# EasyEDA schematic SCH_Pico-Greenhouse-PCB_2026-05-22.json
TITLE: Greenhouse-Pico; REV: 2.1; Date: 2026-04-07; Sheet: 1/1; Drawn By: hiroyugane
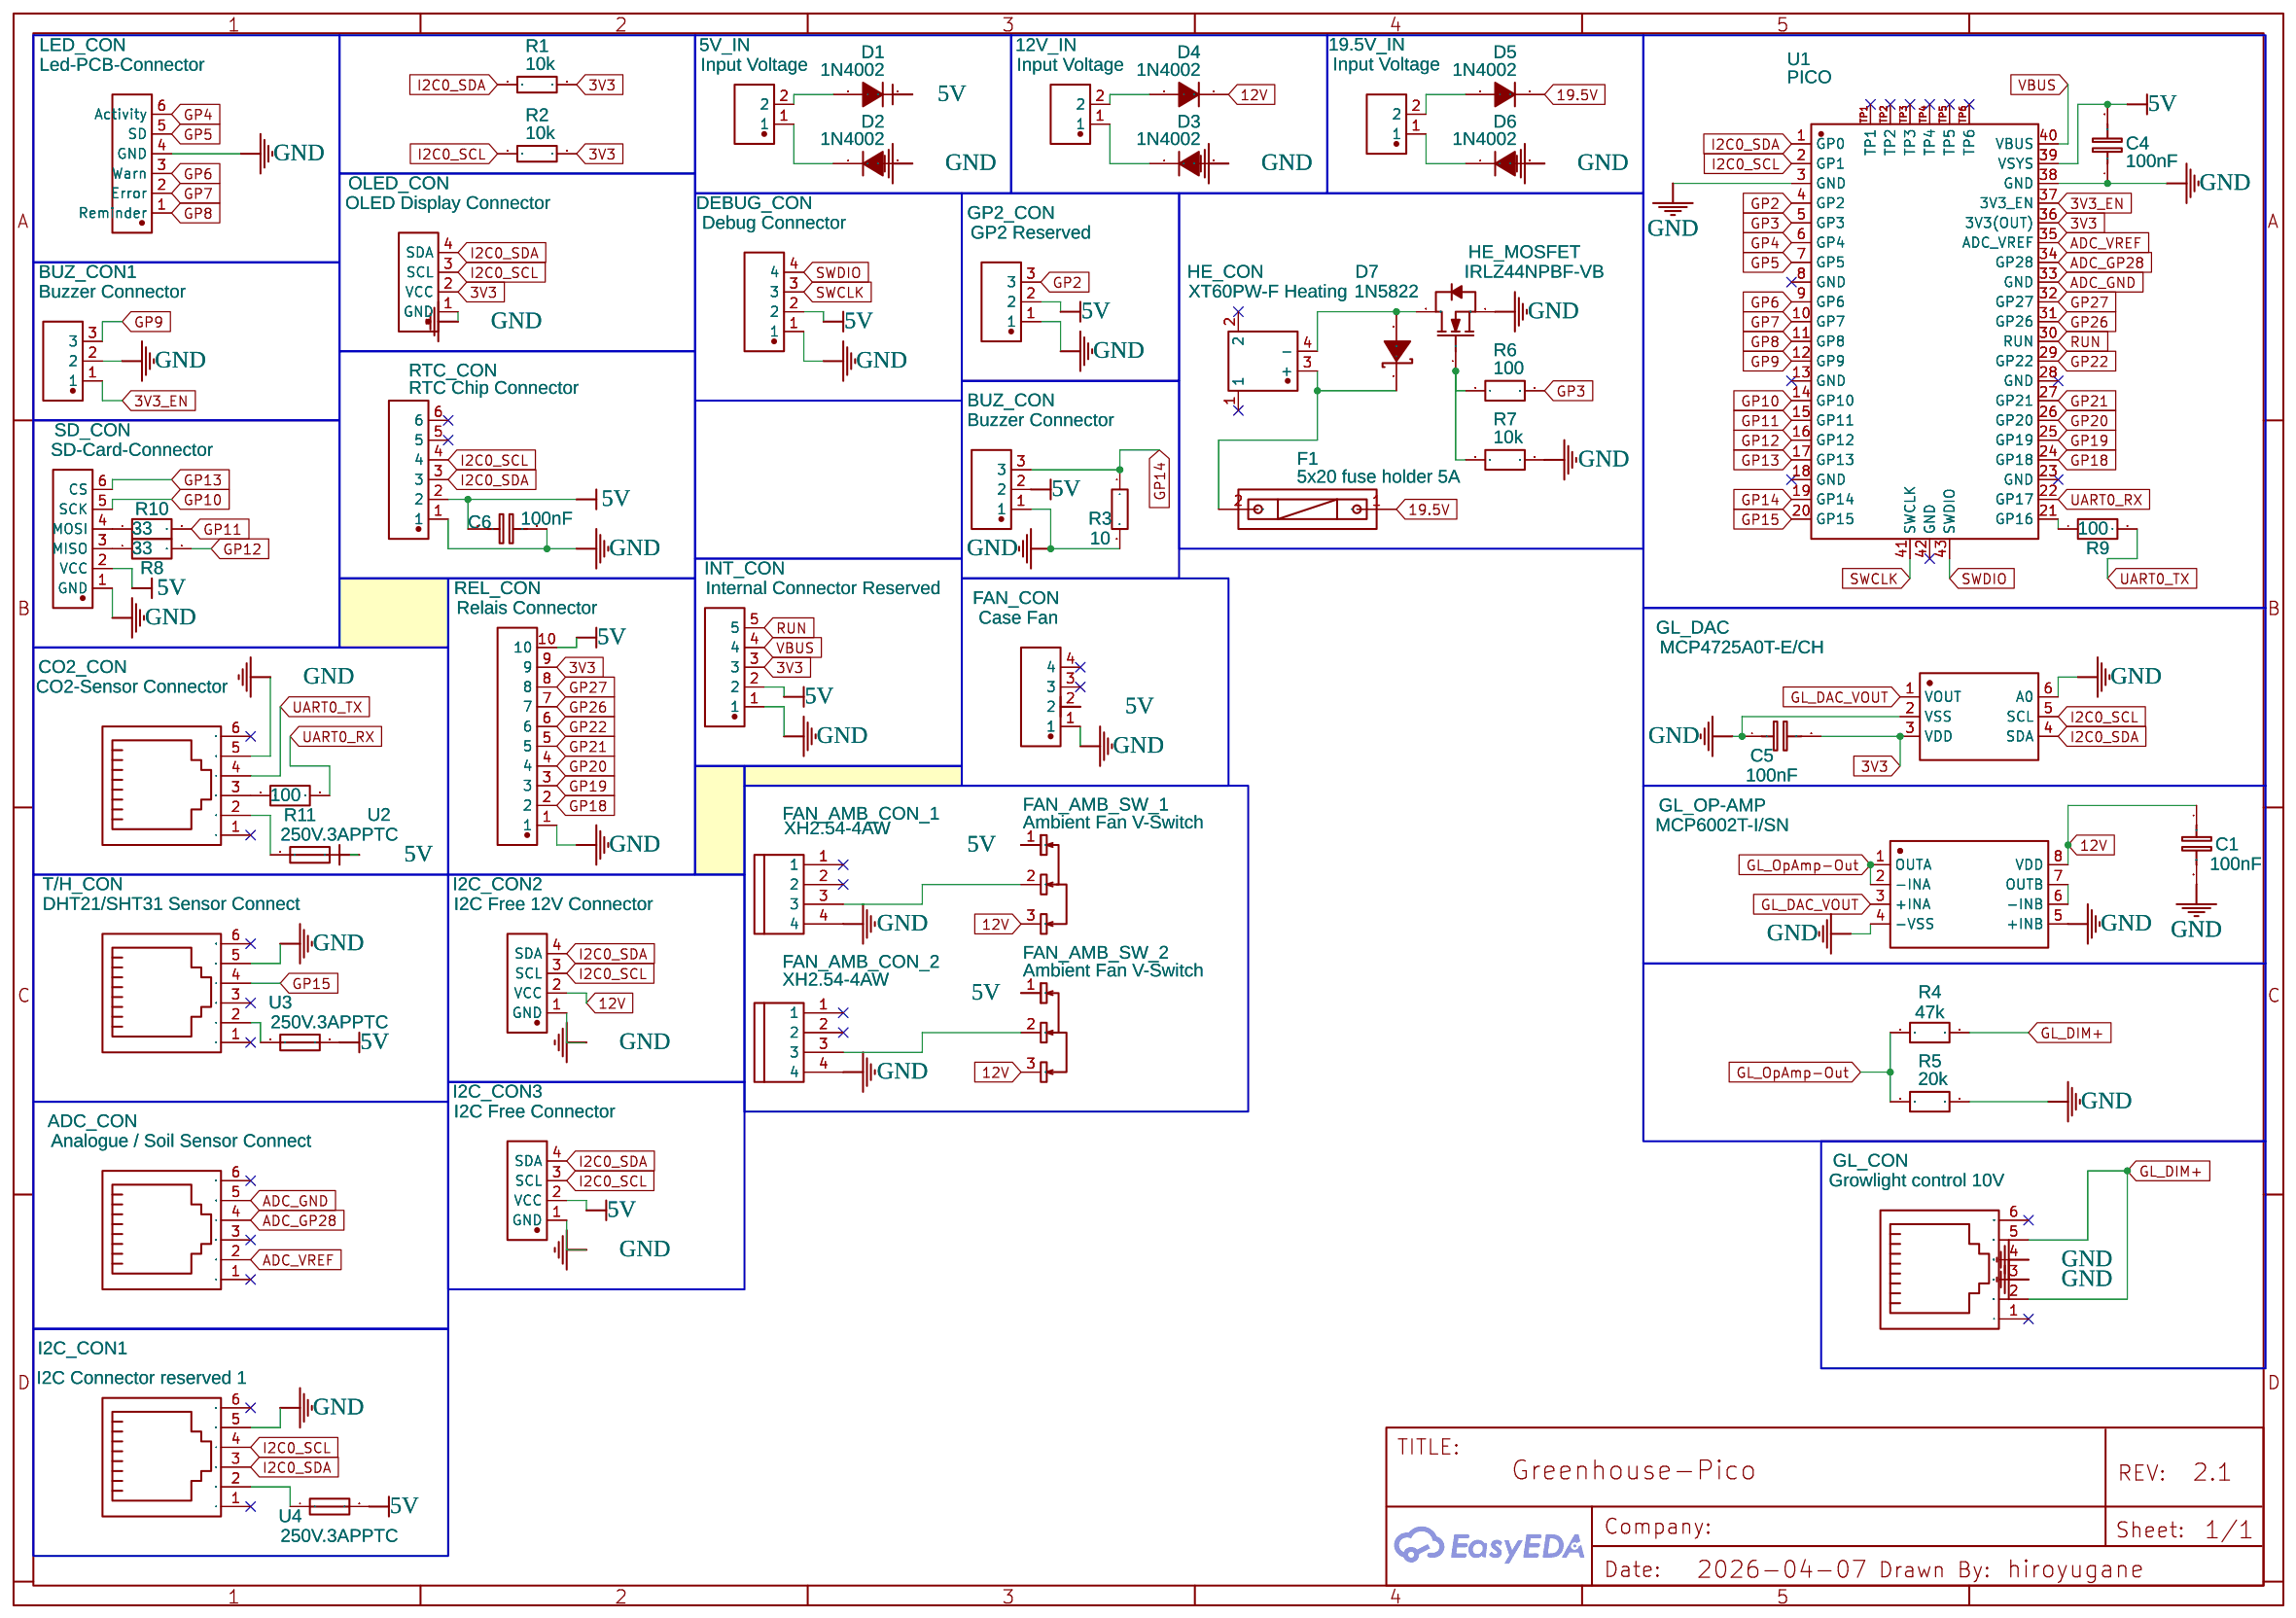
[diagram p0: schematic sheet]

## Parts
5V_IN  Input Voltage  [CONN-TH_2P-P2.50_JST_B2B-XH-A-M]
12V_IN  Input Voltage  [CONN-TH_2P-P2.50_JST_B2B-XH-A-M]
19.5V_IN  Input Voltage  [CONN-TH_2P-P5.00_1935161]
ADC_CON  Analogue / Soil Sensor Connect  [RJ12-TH_95501-2661]
BUZ_CON  Buzzer Connector  [BUZ_CON]
BUZ_CON1  Buzzer Connector  [BUZ_CON]
C1  100nF  [CONDENSATOR-SMALL]
C4  100nF  [CONDENSATOR-SMALL]
C5  100nF  [CONDENSATOR-SMALL]
C6  100nF  [CONDENSATOR-SMALL]
CO2_CON  CO2-Sensor Connector  [RJ12-TH_95501-2661]
D1  1N4002  [DO-41_BD2.4-L4.7-P8.70-D0.9-RD]
D2  1N4002  [DO-41_BD2.4-L4.7-P8.70-D0.9-RD]
D3  1N4002  [DO-41_BD2.4-L4.7-P8.70-D0.9-RD]
D4  1N4002  [DO-41_BD2.4-L4.7-P8.70-D0.9-RD]
D5  1N4002  [DO-41_BD2.4-L4.7-P8.70-D0.9-RD]
D6  1N4002  [DO-41_BD2.4-L4.7-P8.70-D0.9-RD]
D7  1N5822  [DO-201AD_BD5.3-L8.4-P12.50-D1.4-FD]
DEBUG_CON  Debug Connector  [CONN-TH_4P-P2.50_JST_B4B-XH-A-M]
F1  5x20 fuse holder 5A  [FUSE-TH_L22.6-W9.0]
FAN_AMB_CON_1  XH2.54-4AW  [CONN-TH_XH2.54-4AW]
FAN_AMB_CON_2  XH2.54-4AW  [CONN-TH_XH2.54-4AW]
FAN_AMB_SW_1  Ambient Fan V-Switch  [TH SWITCH SPDT]
FAN_AMB_SW_2  Ambient Fan V-Switch  [TH SWITCH SPDT]
FAN_CON  Case Fan  [CONN-TH_4P-P2.50_JST_B4B-XH-A-M]
GL_CON  Growlight control 10V  [RJ12-TH_95501-2661]
GL_DAC  MCP4725A0T-E/CH  [SOT-23-6_L2.9-W1.6-P0.95-LS2.8-BL]
GL_OP-AMP  MCP6002T-I/SN  [SOIC-8_L4.9-W3.9-P1.27-LS6.0-BL]
GP2_CON  GP2 Reserved  [CONN-TH_3P-P2.50_B3B-XH-A-BK-LF-SN]
HE_CON  XT60PW-F Heating  [TH_2P-XT60PW-F]
HE_MOSFET  IRLZ44NPBF-VB  [TO-220-3_L10.0-W4.5-P2.54-L-2]
I2C_CON1  I2C Connector reserved 1  [RJ12-TH_95501-2661]
I2C_CON2  I2C Free 12V Connector  [CONN-TH_4P-P2.50_JST_B4B-XH-A-M]
I2C_CON3  I2C Free Connector  [CONN-TH_4P-P2.50_JST_B4B-XH-A-M]
INT_CON  Internal Connector Reserved  [CONN-TH_5P-P2.50_JST_B5B-XH-A-M]
LED_CON  Led-PCB-Connector  [CONN-TH_6P-P2.50_JST_B6B-EH-LF-SN]
OLED_CON  OLED Display Connector  [CONN-TH_4P-P2.50_JST_B4B-XH-A-M]
R1  10k  [RES-TH_BD2.3-L6.5-P6.9-D0.5]
R2  10k  [RES-TH_BD2.3-L6.5-P6.9-D0.5]
R3  10  [RES-TH_BD2.3-L6.5-P6.9-D0.5]
R4  47k  [R_TH]
R5  20k  [R_TH]
R6  100  [R_TH]
R7  10k  [R_TH]
R8  33  [R_TH]
R9  100  [R_TH]
R10  33  [R_TH]
R11  100  [R_TH]
REL_CON  Relais Connector  [CONN-TH_10P-P2.50_JST_B10B-EH]
RTC_CON  RTC Chip Connector  [RTC-CHIP FOOTPRINT]
SD_CON  SD-Card-Connector  [CONN-TH_6P-P2.50_JST_B6B-EH-LF-SN]
T/H_CON  DHT21/SHT31 Sensor Connect  [RJ12-TH_95501-2661]
U1  PICO  [RPI-PICO-V2 COPY]
U2  250V.3APPTC  [FUSE-TH_L11.4-W3.0-P5.10-D0.8-S1.20]
U3  250V.3APPTC  [FUSE-TH_L11.4-W3.0-P5.10-D0.8-S1.20]
U4  250V.3APPTC  [FUSE-TH_L11.4-W3.0-P5.10-D0.8-S1.20]

## Library data of the parts
5V_IN 12V_IN = B2B-XH-A-BK(LF)(SN): Supplier: LCSC; Supplier Part: C378939; Manufacturer: JST; JLCPCB Part Class: Extended Part; Contributor: lcsc
19.5V_IN = 1935161: Supplier: LCSC; Supplier Part: C3819953; Manufacturer: Phoenix Contact(菲尼克斯); JLCPCB Part Class: Extended Part; Contributor: lcsc
ADC_CON CO2_CON GL_CON I2C_CON1 T/H_CON = 95501-2661: Contributor: LCSC; Supplier: LCSC; Supplier Part: C240856; Manufacturer: MOLEX; Manufacturer Part: 955012661; JLCPCB Part Class: Extended Part
BUZ_CON BUZ_CON1 GP2_CON = B3B-XH-A-BK(LF)(SN): Contributor: LCSC; Supplier: LCSC; Supplier Part: C493416; Manufacturer: JST; JLCPCB Part Class: Extended Part
C1 C4-C6 = C_0603_EU: Contributor: LCEDA_Lib
D1-D6 = 1N4002-E3/54: Supplier: LCSC; Manufacturer: VISHAY(威世); Supplier Part: C33504; JLCPCB Part Class: Extended Part
D7 = 1N5822: Supplier: LCSC; Manufacturer: MDD(辰达半导体); Supplier Part: C2476; JLCPCB Part Class: Extended Part
DEBUG_CON FAN_CON I2C_CON2 I2C_CON3 OLED_CON = B4B-XH-A-R(LF)(SN): Contributor: lcsc; Supplier: LCSC; Supplier Part: C595709; Manufacturer: JST; JLCPCB Part Class: Extended Part
F1 = 5x20 BLX-Atype Fuse holder XC-7: Supplier: LCSC; Manufacturer Part: 5x20 BLX-A型 保险丝支架 XC-7; Manufacturer: xcfuse(旭程); Supplier Part: C3131; JLCPCB Part Class: Extended Part
FAN_AMB_CON_1 FAN_AMB_CON_2 = XH2.54-4AW: Supplier: LCSC; Manufacturer: BOOMELE(博穆精密); Manufacturer Part: XH-4AW; Supplier Part: C21273; JLCPCB Part Class: Extended Part
FAN_AMB_SW_1 FAN_AMB_SW_2 = MST-12D18G4 SPDT SLIDE SWITCH: Supplier: LCSC; Supplier Part: C49023767; Manufacturer: SHOU HAN(首韩); Manufacturer Part: MST-12D18G4 SPDT Slide Switch; JLCPCB Part Class: Extended Part; Contributor: lcsc
GL_DAC = MCP4725A0T-E/CH: Contributor: LCSC; Supplier: LCSC; Manufacturer: MICROCHIP(美国微芯); Supplier Part: C144198; JLCPCB Part Class: Extended Part
GL_OP-AMP = MCP6002T-I/SN: Supplier: LCSC; Manufacturer: MICROCHIP(美国微芯); Supplier Part: C7377; JLCPCB Part Class: Extended Part
HE_CON = XT60PW-F_C428722: Supplier: LCSC; Supplier Part: C428722; Manufacturer: AMASS(艾迈斯); Manufacturer Part: XT60PW-F; JLCPCB Part Class: Extended Part; Contributor: lcsc
HE_MOSFET = IRLZ44NPBF-VB: Supplier: LCSC; Supplier Part: C20755022; Manufacturer: VBsemi(微碧半导体); JLCPCB Part Class: Extended Part; Contributor: lcsc
INT_CON = B5B-XH-A-M(LF)(SN): Contributor: LCSC; Supplier: LCSC; Supplier Part: C495550; Manufacturer: JST; JLCPCB Part Class: Extended Part
LED_CON SD_CON = B6B-EH(LF)(SN): Contributor: LCSC; Supplier: LCSC; Supplier Part: C493147; Manufacturer: JST; JLCPCB Part Class: Extended Part
R1-R3 = 330Ω (331) ±5%: Contributor: LCSC; Supplier: LCSC; Supplier Part: C10322; Manufacturer: Made in China; JLCPCB Part Class: Extended Part
R4-R11 = R_0603_EU: Contributor: LCEDA_Lib
REL_CON = B10B-EH(LF)(SN): Contributor: lcsc; Supplier: LCSC; Supplier Part: C265062; Manufacturer: JST; JLCPCB Part Class: Extended Part
RTC_CON = ZX-PM2.54-1-6PY: Supplier: LCSC; Supplier Part: C7499326; Manufacturer: Megastar(兆星); Contributor: lcsc; JLCPCB Part Class: Extended Part
U1 = PICO: Supplier: LCSC; Supplier Part: C7203002; Manufacturer: Raspberry Pi(树莓派); Contributor: lcsc; JLCPCB Part Class: Extended Part
U2-U4 = 30V3APPTC: Contributor: lcsc; Supplier: LCSC; Supplier Part: C9900014925; Manufacturer: null; JLCPCB Part Class: Extended Part

## Nets
3V3: C5.2 GL_DAC.3(VDD) INT_CON.3 OLED_CON.2(VCC) R1.2 R2.2 REL_CON.9 U1.36(3V3(OUT))
3V3_EN: BUZ_CON1.1 U1.37(3V3_EN)
5V: BUZ_CON.2 C4.2 C6.1 D1.1(C) DEBUG_CON.2 FAN_AMB_SW_1.1 FAN_AMB_SW_2.1 FAN_CON.2 GP2_CON.2 I2C_CON3.2(VCC) INT_CON.2 REL_CON.10 RTC_CON.2 SD_CON.2(VCC) U1.39(VSYS) U2.2 U3.2 U4.2
12V: C1.1 D4.1(C) FAN_AMB_SW_1.3 FAN_AMB_SW_2.3 GL_OP-AMP.8(VDD) I2C_CON2.2(VCC)
19.5V: D5.1(C) F1.1
GND: BUZ_CON.1 BUZ_CON1.2 C1.2 C4.1 C5.1 C6.2 CO2_CON.5 D2.2(A) D3.2(A) D6.2(A) DEBUG_CON.1 FAN_AMB_CON_1.4 FAN_AMB_CON_2.4 FAN_CON.1 GL_CON.3(GL-) GL_CON.4(GL-) GL_DAC.2(VSS) GL_DAC.6(A0) GL_OP-AMP.4(-VSS) GL_OP-AMP.5(+INB) GP2_CON.1 HE_MOSFET.3(S) I2C_CON1.5 I2C_CON2.1(GND) I2C_CON3.1(GND) INT_CON.1 LED_CON.4(GND) OLED_CON.1(GND) R3.2 R5.2 R7.1 REL_CON.1 RTC_CON.1 SD_CON.1(GND) T/H_CON.5 U1.3(GND) U1.38(GND)
VBUS: INT_CON.4 U1.40(VBUS)
ADC_GND: ADC_CON.5 U1.33(GND)
ADC_GP28: ADC_CON.4 U1.34(GP28)
ADC_VREF: ADC_CON.2 U1.35(ADC_VREF)
GL_DAC_VOUT: GL_DAC.1(VOUT) GL_OP-AMP.3(+INA)
GL_DIM+: GL_CON.2(GL+) GL_CON.5(GL+) R4.2
GL_OpAmp-Out: GL_OP-AMP.1(OUTA) GL_OP-AMP.2(-INA) R4.1 R5.1
GP2: GP2_CON.3 U1.4(GP2)
GP3: R6.2 U1.5(GP3)
GP4: LED_CON.6(Activity) U1.6(GP4)
GP5: LED_CON.5(SD) U1.7(GP5)
GP6: LED_CON.3(Warn) U1.9(GP6)
GP7: LED_CON.2(Error) U1.10(GP7)
GP8: LED_CON.1(Reminder) U1.11(GP8)
GP9: BUZ_CON1.3 U1.12(GP9)
GP10: SD_CON.5(SCK) U1.14(GP10)
GP11: R10.2 U1.15(GP11)
GP12: R8.2 U1.16(GP12)
GP13: SD_CON.6(CS) U1.17(GP13)
GP14: BUZ_CON.3 R3.1 U1.19(GP14)
GP15: T/H_CON.4 U1.20(GP15)
GP18: REL_CON.2 U1.24(GP18)
GP19: REL_CON.3 U1.25(GP19)
GP20: REL_CON.4 U1.26(GP20)
GP21: REL_CON.5 U1.27(GP21)
GP22: REL_CON.6 U1.29(GP22)
GP26: REL_CON.7 U1.31(GP26)
GP27: REL_CON.8 U1.32(GP27)
I2C0_SCL: GL_DAC.5(SCL) I2C_CON1.4 I2C_CON2.3(SCL) I2C_CON3.3(SCL) OLED_CON.3(SCL) R2.1 RTC_CON.4 U1.2(GP1)
I2C0_SDA: GL_DAC.4(SDA) I2C_CON1.3 I2C_CON2.4(SDA) I2C_CON3.4(SDA) OLED_CON.4(SDA) R1.1 RTC_CON.3 U1.1(GP0)
RUN: INT_CON.5 U1.30(RUN)
SWCLK: DEBUG_CON.3 U1.41(SWCLK)
SWDIO: DEBUG_CON.4 U1.43(SWDIO)
UART0_RX: R11.2 U1.22(GP17)
UART0_TX: CO2_CON.4 R9.2
Net-(5V_IN-1): 5V_IN.1 D2.1(C)
Net-(5V_IN-2): 5V_IN.2 D1.2(A)
Net-(12V_IN-1): 12V_IN.1 D3.1(C)
Net-(12V_IN-2): 12V_IN.2 D4.2(A)
Net-(19.5V_IN-1): 19.5V_IN.1 D6.1(C)
Net-(19.5V_IN-2): 19.5V_IN.2 D5.2(A)
Net-(CO2_CON-2): CO2_CON.2 U2.1
Net-(CO2_CON-3): CO2_CON.3 R11.1
Net-(D7-1): D7.1(A) HE_CON.4(-) HE_MOSFET.2(D)
Net-(D7-2): D7.2(K) F1.2 HE_CON.3(+)
Net-(FAN_AMB_CON_1-3): FAN_AMB_CON_1.3 FAN_AMB_SW_1.2
Net-(FAN_AMB_CON_2-3): FAN_AMB_CON_2.3 FAN_AMB_SW_2.2
Net-(GL_OP-AMP-6): GL_OP-AMP.6(-INB) GL_OP-AMP.7(OUTB)
Net-(HE_MOSFET-1): HE_MOSFET.1(G) R6.1 R7.2
Net-(I2C_CON1-2): I2C_CON1.2 U4.1
Net-(R8-1): R8.1 SD_CON.3(MISO)
Net-(R9-1): R9.1 U1.21(GP16)
Net-(R10-1): R10.1 SD_CON.4(MOSI)
Net-(T/H_CON-2): T/H_CON.2 U3.1

Not connected (* = marked no-connect by the designer): ADC_CON 1* 3* 6*; CO2_CON 1* 6*; FAN_AMB_CON_1 1* 2*; FAN_AMB_CON_2 1* 2*; FAN_CON 3* 4*; GL_CON 1* 6*; HE_CON 1* 2*; I2C_CON1 1* 6*; RTC_CON 5* 6*; T/H_CON 1* 3* 6*; U1 8(GND)* 13(GND)* 18(GND)* 23(GND)* 28(GND)* 42(GND)* TP1* TP2* TP3* TP4* TP5* TP6*
